# Altium schematic sheet UD3.1 PSOC.SchDoc
size A4; DocumentNumber: 3; SheetNumber: 3; SheetTotal: 7; PageSetup: Record=PageOptions|CenterHorizontal=True|CenterVertical=True|PrintScale=0.54|XCorrection=1.00|YCorrection=1.00|PrintKind=0|BorderSize=5000000|LeftOffset=0|BottomOffset=0|Orientation=2|PaperLength=1000|PaperWidth=1000|Scale=100|PaperSource=7|PrintQuality=-4|MediaType=1|DitherType=10|PaperKind=Letter|PrintScaleMode=1
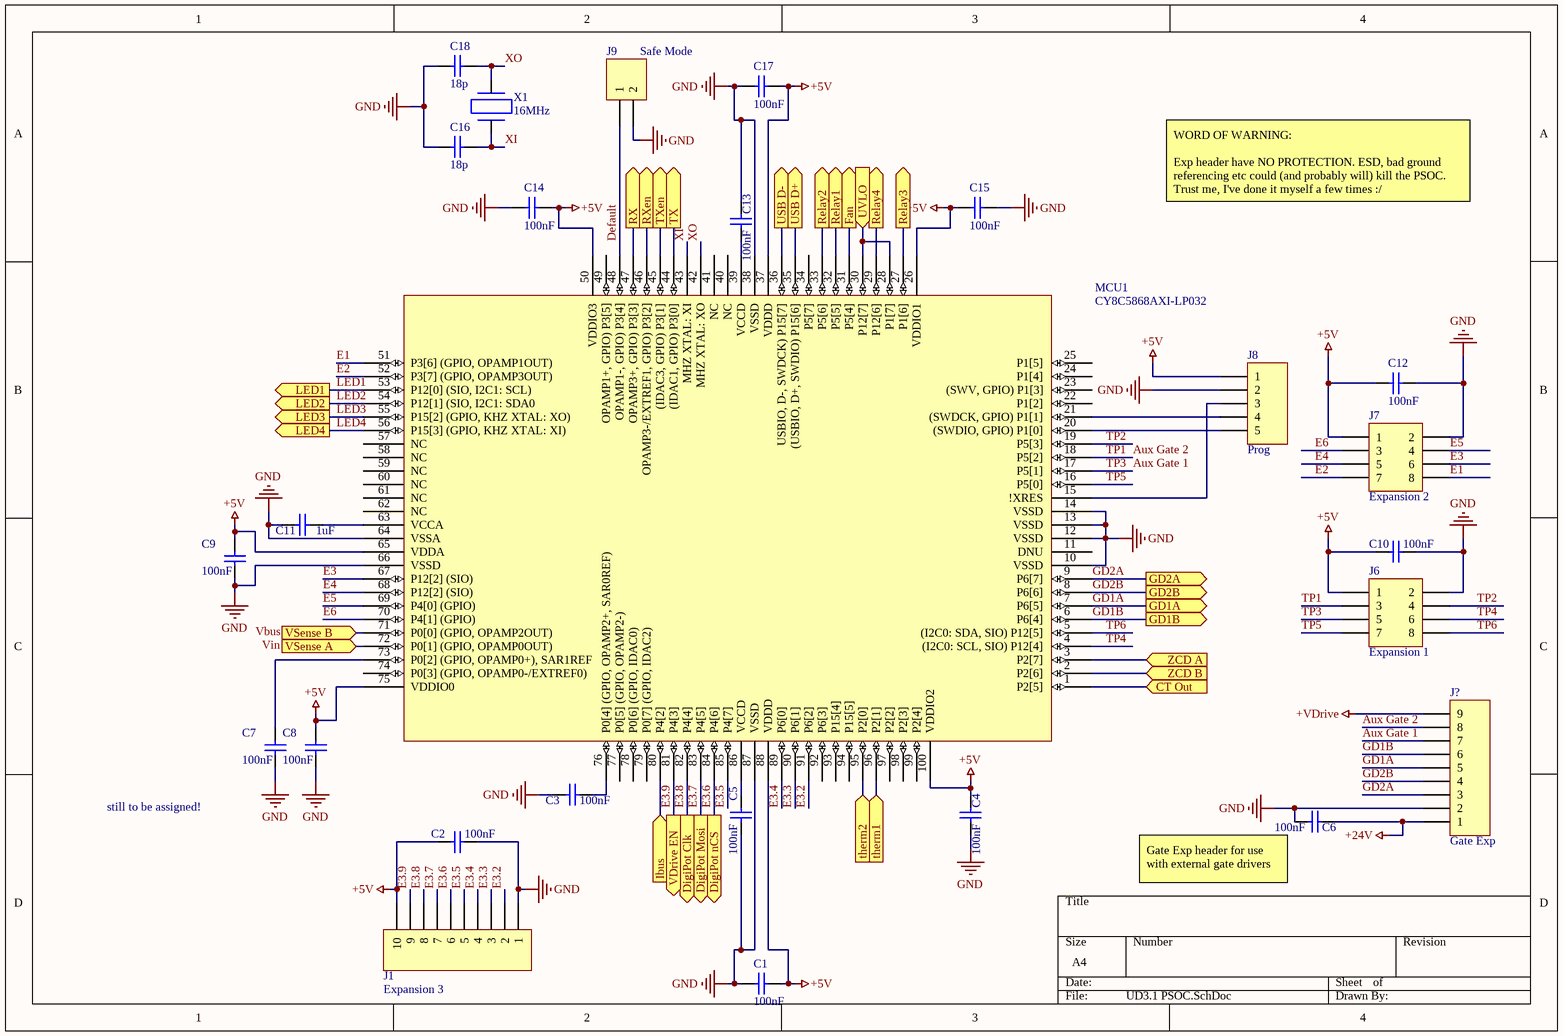
[diagram p0: UD3.1 PSOC.SchDoc]

## Parts
C1  100nF  [0603]
C2  100nF  [0603]
C3  100nF  [0603]
C4  100nF  [0603]
C5  100nF  [0603]
C6  100nF  [0805]
C7  100nF  [0603]
C8  100nF  [0603]
C9  100nF  [0603]
C10  100nF  [0603]
C11  1uF  [0603]
C12  100nF  [0603]
C13  100nF  [0603]
C14  100nF  [0603]
C15  100nF  [0603]
C16  18p  [0603]
C17  100nF  [0603]
C18  18p  [0603]
J1  Expansion 3  [HDR1X10]
J6  Expansion 1  [HDR2X4]
J7  Expansion 2  [HDR2X4]
J8  Prog  [HDR1X5]
J9  Safe Mode  [HDR1X2]
J?  Gate Exp  [HDR1X9]
MCU1  CY8C5868AXI-LP032  [TQFP 100]
X1  16MHz  [ECS-3225MV Oscillator]

## Ports
CT Out (in), DigiPot Clk (out), DigiPot Mosi (out), DigiPot nCS (out), Fan (out), GD1A (out), GD1B (out), GD2A (out), GD2B (out), Ibus (in), LED1 (out), LED2 (out), LED3 (out), LED4 (out), Relay1 (out), Relay2 (out), Relay3 (out), Relay4 (out), RX (out), RXen (out), therm1 (in), therm2 (in), TX (out), TXen (out), USB D+ (out), USB D- (out), UVLO (in), VDrive EN (out), VSense A (in), VSense B (in), ZCD A (in), ZCD B (in)

## Nets
+5V: C1.2 C2.1 C4.2 C8.2 C9.2 C10.1 C12.2 C14.2 C15.2 C17.2 J1.10 J6.1 J7.1 J8.1 MCU1.26(VDDIO1) MCU1.37(VDDD) MCU1.50(VDDIO3) MCU1.65(VDDA) MCU1.75(VDDIO0) MCU1.88(VDDD) MCU1.100(VDDIO2)
+24V: C6.2 J?.1
+VDrive: J?.9
GND: C1.1 C2.2 C3.1 C4.1 C5.1 C6.1 C7.1 C8.1 C9.1 C10.2 C11.1 C12.1 C13.1 C14.1 C15.1 C16.2 C17.1 C18.2 J1.1 J6.2 J7.2 J8.2 J9.2 J?.2 MCU1.10(VSSD) MCU1.12(VSSD) MCU1.13(VSSD) MCU1.14(VSSD) MCU1.38(VSSD) MCU1.64(VSSA) MCU1.66(VSSD) MCU1.87(VSSD)
Aux Gate 1: J6.5 J?.7 MCU1.17(P5[1])  [also labelled TP3]
Aux Gate 2: J6.3 J?.8 MCU1.18(P5[2])  [also labelled TP1]
CT Out: MCU1.1(P2[5]) ; port CT Out
Default: J9.1 MCU1.48(OPAMP1-,_GPIO)_P3[4])
E1: J7.8 MCU1.51(P3[6]_(GPIO,_OPAMP1OUT))
E2: J7.7 MCU1.52(P3[7]_(GPIO,_OPAMP3OUT))
E3: J7.6 MCU1.67(P12[2]_(SIO))
E3.2: J1.2 MCU1.91(P6[2])
E3.3: J1.3 MCU1.90(P6[1])
E3.4: J1.4 MCU1.89(P6[0])
E3.5: J1.5 MCU1.85(P4[7])
E3.6: J1.6 MCU1.84(P4[6]) ; port DigiPot nCS
E3.7: J1.7 MCU1.83(P4[5]) ; port DigiPot Mosi
E3.8: J1.8 MCU1.82(P4[4]) ; port DigiPot Clk
E3.9: J1.9 MCU1.81(P4[3]) ; port VDrive EN
E4: J7.5 MCU1.68(P12[2]_(SIO))
E5: J7.4 MCU1.69(P4[0]_(GPIO))
E6: J7.3 MCU1.70(P4[1]_(GPIO))
Fan: MCU1.31(P5[4]) ; port Fan
GD1A: J?.5 MCU1.7(P6[5]) ; port GD1A
GD1B: J?.6 MCU1.6(P6[4]) ; port GD1B
GD2A: J?.3 MCU1.9(P6[7]) ; port GD2A
GD2B: J?.4 MCU1.8(P6[6]) ; port GD2B
Ibus: MCU1.80(P4[2]) ; port Ibus
LED1: MCU1.53(P12[0]_(SIO,_I2C1:_SCL)) ; port LED1
LED2: MCU1.54(P12[1]_(SIO,_I2C1:_SDA0) ; port LED2
LED3: MCU1.55(P15[2]_(GPIO,_KHZ_XTAL:_XO)) ; port LED3
LED4: MCU1.56(P15[3]_(GPIO,_KHZ_XTAL:_XI)) ; port LED4
Relay1: MCU1.32(P5[5]) ; port Relay1
Relay2: MCU1.33(P5[6]) ; port Relay2
Relay3: MCU1.27(P1[6]) ; port Relay3
Relay4: MCU1.29(P12[6]) ; port Relay4
RX: MCU1.47(OPAMP3+,_GPIO)_P3[3]) ; port RX
RXen: MCU1.46(OPAMP3-/EXTREF1,_GPIO)_P3[2]) ; port RXen
therm1: MCU1.96(P2[1]) ; port therm1
therm2: MCU1.95(P2[0]) ; port therm2
TP2: J6.4 MCU1.19(P5[3])
TP4: J6.6 MCU1.4((I2C0:_SCL,_SIO)_P12[4])
TP5: J6.7 MCU1.16(P5[0])
TP6: J6.8 MCU1.5((I2C0:_SDA,_SIO)_P12[5])
TX: MCU1.44((IDAC1,_GPIO)_P3[0]) ; port TX
TXen: MCU1.45((IDAC3,_GPIO)_P3[1]) ; port TXen
USB D+: MCU1.35((USBIO,_D+,_SWDIO)_P15[6]) ; port USB D+
USB D-: MCU1.36(USBIO,_D-,_SWDCK)_P15[7]) ; port USB D-
UVLO: MCU1.28(P1[7]) MCU1.30(P12[7]) ; port UVLO
VSense A: MCU1.72(P0[1]_(GPIO,_OPAMP0OUT)) ; port VSense A
VSense B: MCU1.71(P0[0]_(GPIO,_OPAMP2OUT)) ; port VSense B
XI: C16.1 MCU1.43(MHZ_XTAL:_XI) X1.2
XO: C18.1 MCU1.42(MHZ_XTAL:_XO) X1.1
ZCD A: MCU1.3(P2[7]) ; port ZCD A
ZCD B: MCU1.2(P2[6]) ; port ZCD B
NetC3_2: C3.2 MCU1.76(P0[4]_(GPIO,_OPAMP2+,_SAR0REF))
NetC5_2: C5.2 MCU1.86(VCCD)
NetC7_2: C7.2 MCU1.73(P0[2]_(GPIO,_OPAMP0+),_SAR1REF)
NetC11_2: C11.2 MCU1.63(VCCA)
NetC13_2: C13.2 MCU1.39(VCCD)
NetJ8_3: J8.3 MCU1.15(!XRES)
NetJ8_4: J8.4 MCU1.21((SWDCK,_GPIO)_P1[1])
NetJ8_5: J8.5 MCU1.20((SWDIO,_GPIO)_P1[0])

Not connected (* = marked no-connect by the designer): MCU1 11(DNU) 22(P1[2]) 23((SWV,_GPIO)_P1[3]) 24(P1[4]) 25(P1[5]) 34(P5[7]) 40(NC) 41(NC) 49(OPAMP1+,_GPIO)_P3[5]) 57(NC) 58(NC) 59(NC) 60(NC) 61(NC) 62(NC) 74(P0[3]_(GPIO,_OPAMP0-/EXTREF0)) 77(P0[5]_(GPIO,_OPAMP2-)) 78(P0[6]_(GPIO,_IDAC0)) 79(P0[7]_(GPIO,_IDAC2)) 92(P6[3]) 93(P15[4]) 94(P15[5]) 97(P2[2]) 98(P2[3]) 99(P2[4])

## Notes on the sheet
- WORD OF WARNING:
  Exp header have NO PROTECTION. ESD, bad ground referencing etc could (and probably will) kill the PSOC. Trust me, I've done it myself a few times :/
- still to be assigned!
- (near C6) Gate Exp header for use with external gate drivers
- Labels drawn without touching a wire or pin: Vbus, Vin

## Library data of the parts
C1-C18 = Cap
J1 = Header 10: Header, 10-Pin; LatestRevisionDate: 17-Jul-2002; LatestRevisionNote: Re-released for DXP Platform.; Publisher: Altium Limited
J6 J7 = Header 4X2: Header, 4-Pin, Dual row; LatestRevisionDate: 17-Jul-2002; LatestRevisionNote: Re-released for DXP Platform.; Publisher: Altium Limited
J8 = Header 5: Header, 5-Pin; LatestRevisionDate: 17-Jul-2002; LatestRevisionNote: Re-released for DXP Platform.; Publisher: Altium Limited
J9 = Header 2: Header, 2-Pin; LatestRevisionDate: 17-Jul-2002; LatestRevisionNote: Re-released for DXP Platform.; Publisher: Altium Limited
J? = Header 9: Header, 9-Pin; LatestRevisionDate: 17-Jul-2002; LatestRevisionNote: Re-released for DXP Platform.; Publisher: Altium Limited
MCU1 = CY8C5466AXI-064
X1 = Quarz crystal: pin to pad: 1>2 2>4; Supplier 1: Digi-Key; Supplier Part Number 1: SER4069TR-ND